# EAGLE schematic controller-buttons (EAGLE 8.3.2)
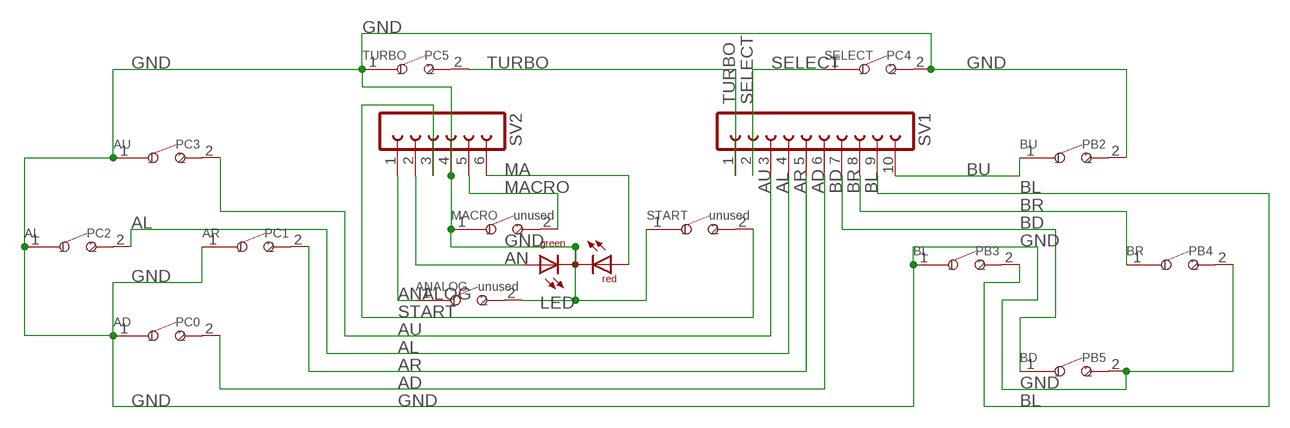
[diagram p0: schematic, sheet 1]

## Parts
AD  PC0  DIP-BUTTON(2P-6.0X3.0X4.3MM)-TS-1101F  [SW2-5.0-6.0X3.0X4.3MM]
AL  PC2  DIP-BUTTON(2P-6.0X3.0X4.3MM)-TS-1101F  [SW2-5.0-6.0X3.0X4.3MM]
ANALOG  unused  DIP-BUTTON(2P-6.0X3.0X4.3MM)-TS-1101F  [SW2-5.0-6.0X3.0X4.3MM]
AR  PC1  DIP-BUTTON(2P-6.0X3.0X4.3MM)-TS-1101F  [SW2-5.0-6.0X3.0X4.3MM]
AU  PC3  DIP-BUTTON(2P-6.0X3.0X4.3MM)-TS-1101F  [SW2-5.0-6.0X3.0X4.3MM]
BD  PB5  DIP-BUTTON(2P-6.0X3.0X4.3MM)-TS-1101F  [SW2-5.0-6.0X3.0X4.3MM]
BL  PB3  DIP-BUTTON(2P-6.0X3.0X4.3MM)-TS-1101F  [SW2-5.0-6.0X3.0X4.3MM]
BR  PB4  DIP-BUTTON(2P-6.0X3.0X4.3MM)-TS-1101F  [SW2-5.0-6.0X3.0X4.3MM]
BU  PB2  DIP-BUTTON(2P-6.0X3.0X4.3MM)-TS-1101F  [SW2-5.0-6.0X3.0X4.3MM]
LED  DUOLED-RG-C  [DUOLED-C-5MM]
MACRO  unused  DIP-BUTTON(2P-6.0X3.0X4.3MM)-TS-1101F  [SW2-5.0-6.0X3.0X4.3MM]
SELECT  PC4  DIP-BUTTON(2P-6.0X3.0X4.3MM)-TS-1101F  [SW2-5.0-6.0X3.0X4.3MM]
START  unused  DIP-BUTTON(2P-6.0X3.0X4.3MM)-TS-1101F  [SW2-5.0-6.0X3.0X4.3MM]
SV1  FE10-1  [FE10]
SV2  FE06-1  [FE06]
TURBO  PC5  DIP-BUTTON(2P-6.0X3.0X4.3MM)-TS-1101F  [SW2-5.0-6.0X3.0X4.3MM]

## Nets
AD: AD.2 SV1.6
AL: AL.2 SV1.4
AN: LED.AX(AG) SV2.2
ANALOG: ANALOG.1 SV2.1
AR: AR.2 SV1.5
AU: AU.2 SV1.3
BD: BD.1 SV1.7
BL: BL.2 SV1.9
BR: BR.1 SV1.8
BU: BU.1 SV1.10
GND: AD.1 AL.1 ANALOG.2 AR.1 AU.1 BD.2 BL.1 BR.2 BU.2 LED.C MACRO.1 SELECT.2 START.1 SV2.4 TURBO.1
MA: LED.AR SV2.6
MACRO: MACRO.2 SV2.5
SELECT: SELECT.1 SV1.2
START: START.2 SV2.3
TURBO: SV1.1 TURBO.2

## Library data of the parts
AD AL ANALOG AR AU BD BL BR BU MACRO SELECT START TURBO = Seeed-Switch:DIP-BUTTON(2P-6.0X3.0X4.3MM): 311020025; MPN: TS-1101F; VALUE: TS-1101F
LED = led:DUOLED-RG-C: DUO LED 2 colors (red/green), 5 mm, round, common Cathode www.ligitek.com or other producers.
SV1 = con-lsta:FE10-1: FEMALE HEADER; OC_FARNELL: unknown; OC_NEWARK: unknown
SV2 = con-lsta:FE06-1: FEMALE HEADER; OC_FARNELL: unknown; OC_NEWARK: unknown